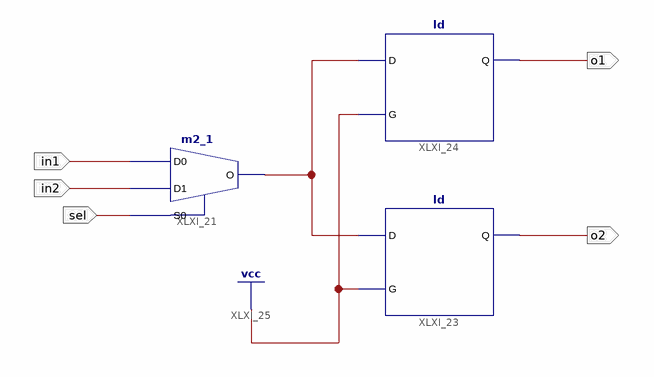
[diagram p0: schematic sheet 1]
// Xilinx ISE schematic test_buf.sch (aspartan6) as structural Verilog: 3 symbols, 5 ports
module test_buf (
  input  in1,
  input  in2,
  input  sel,
  output o1,
  output o2
);

  wire XLXN_15;

  m2_1 XLXI_21 (.D0(in1), .D1(in2), .S0(sel), .O(XLXN_15));
  ld XLXI_23 (.D(XLXN_15), .G(1'b1), .Q(o2));
  ld XLXI_24 (.D(XLXN_15), .G(1'b1), .Q(o1));
endmodule
